# Altium schematic sheet Sheet1.SchDoc
size A2
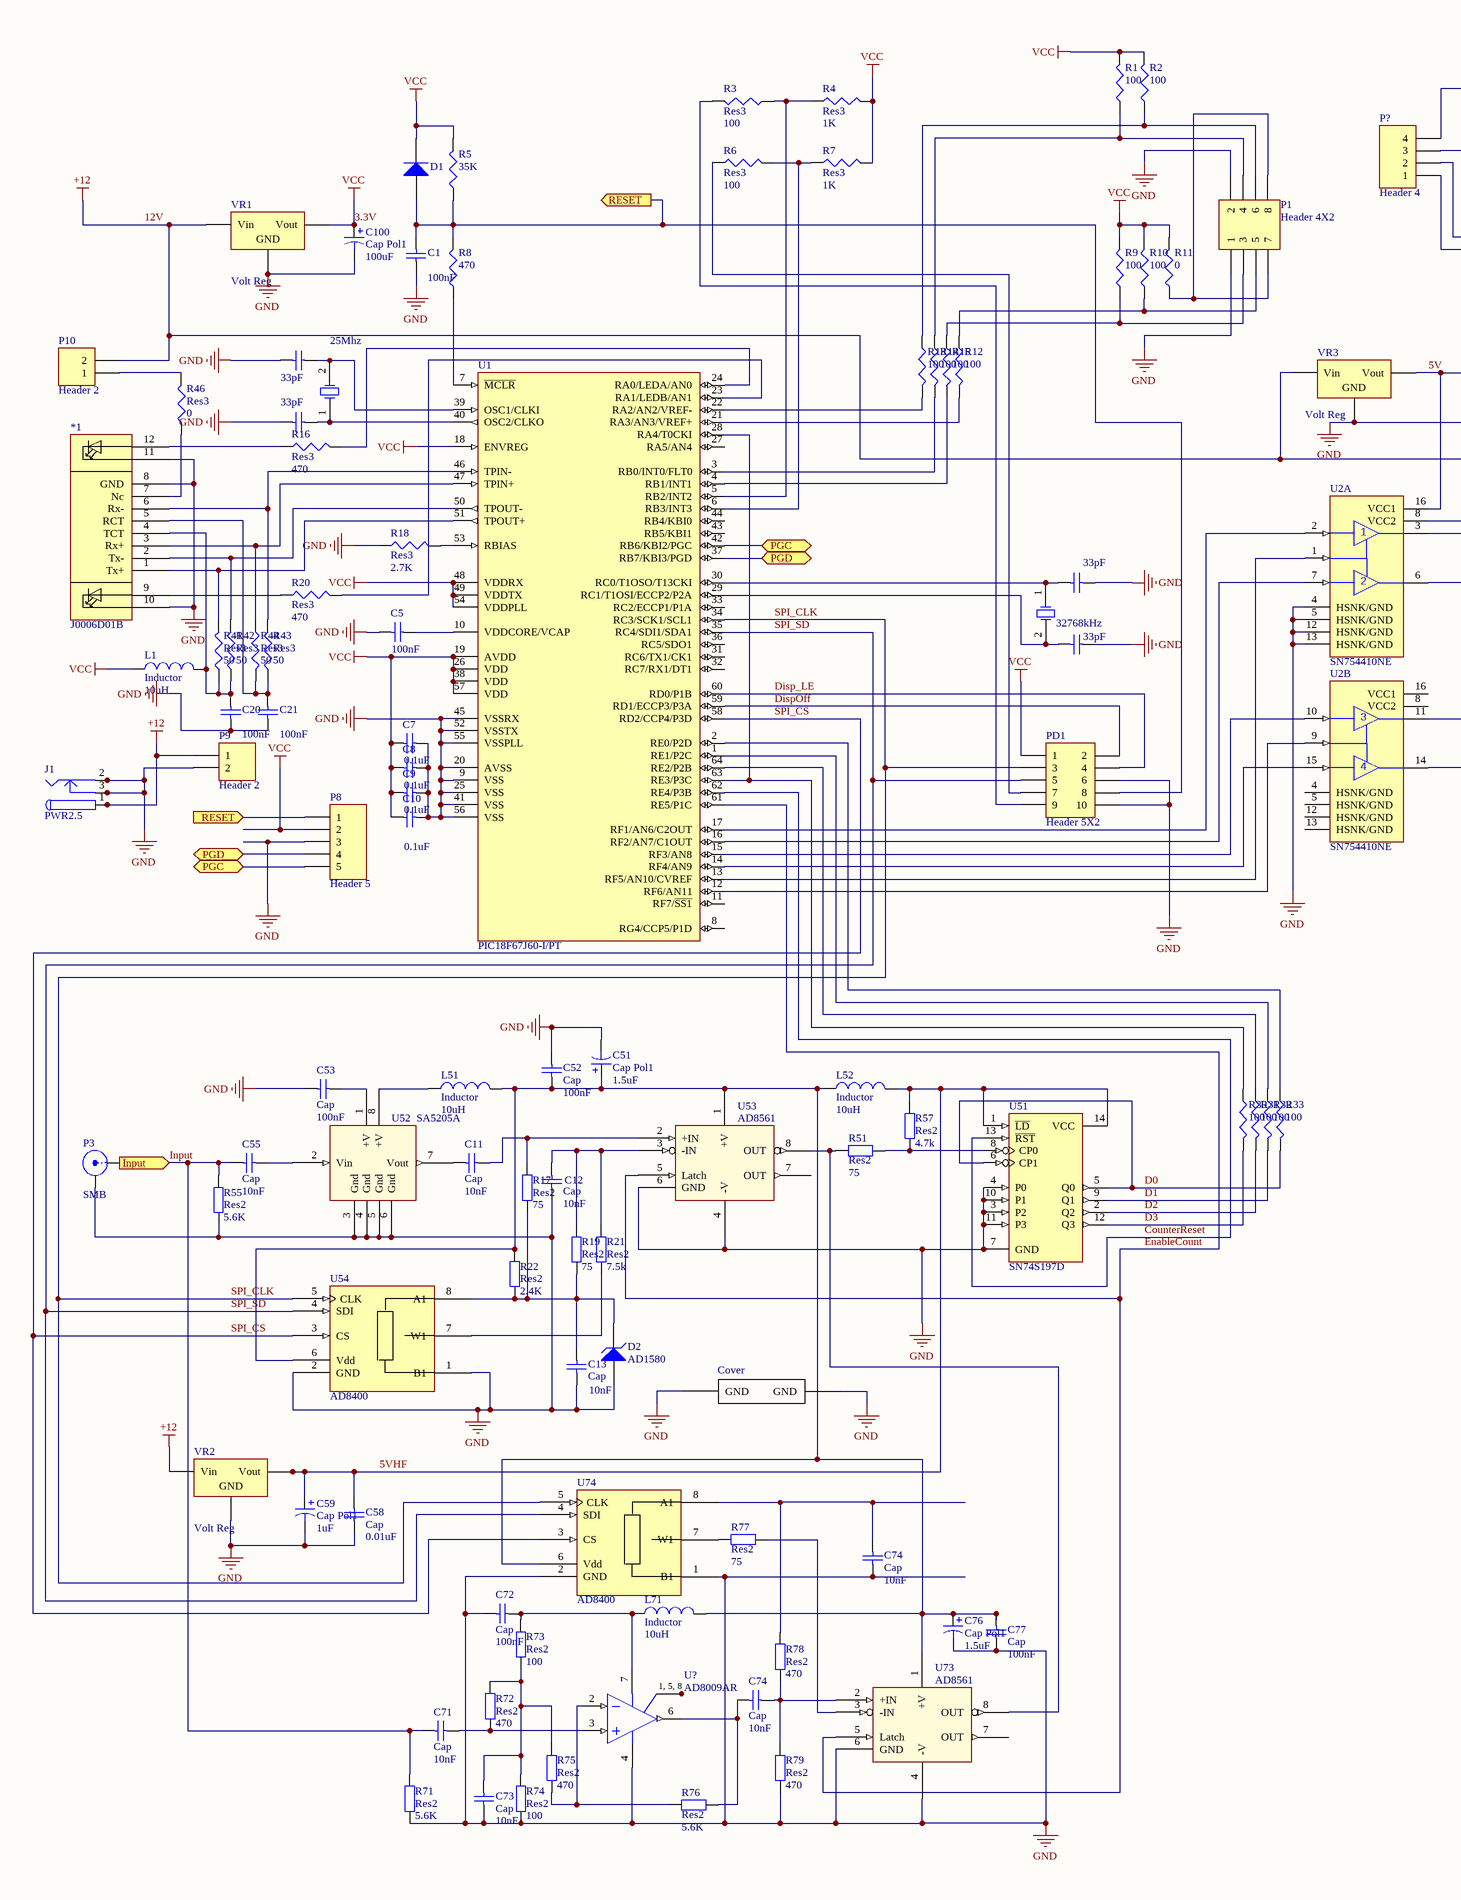
[diagram p0: Sheet1.SchDoc, left]
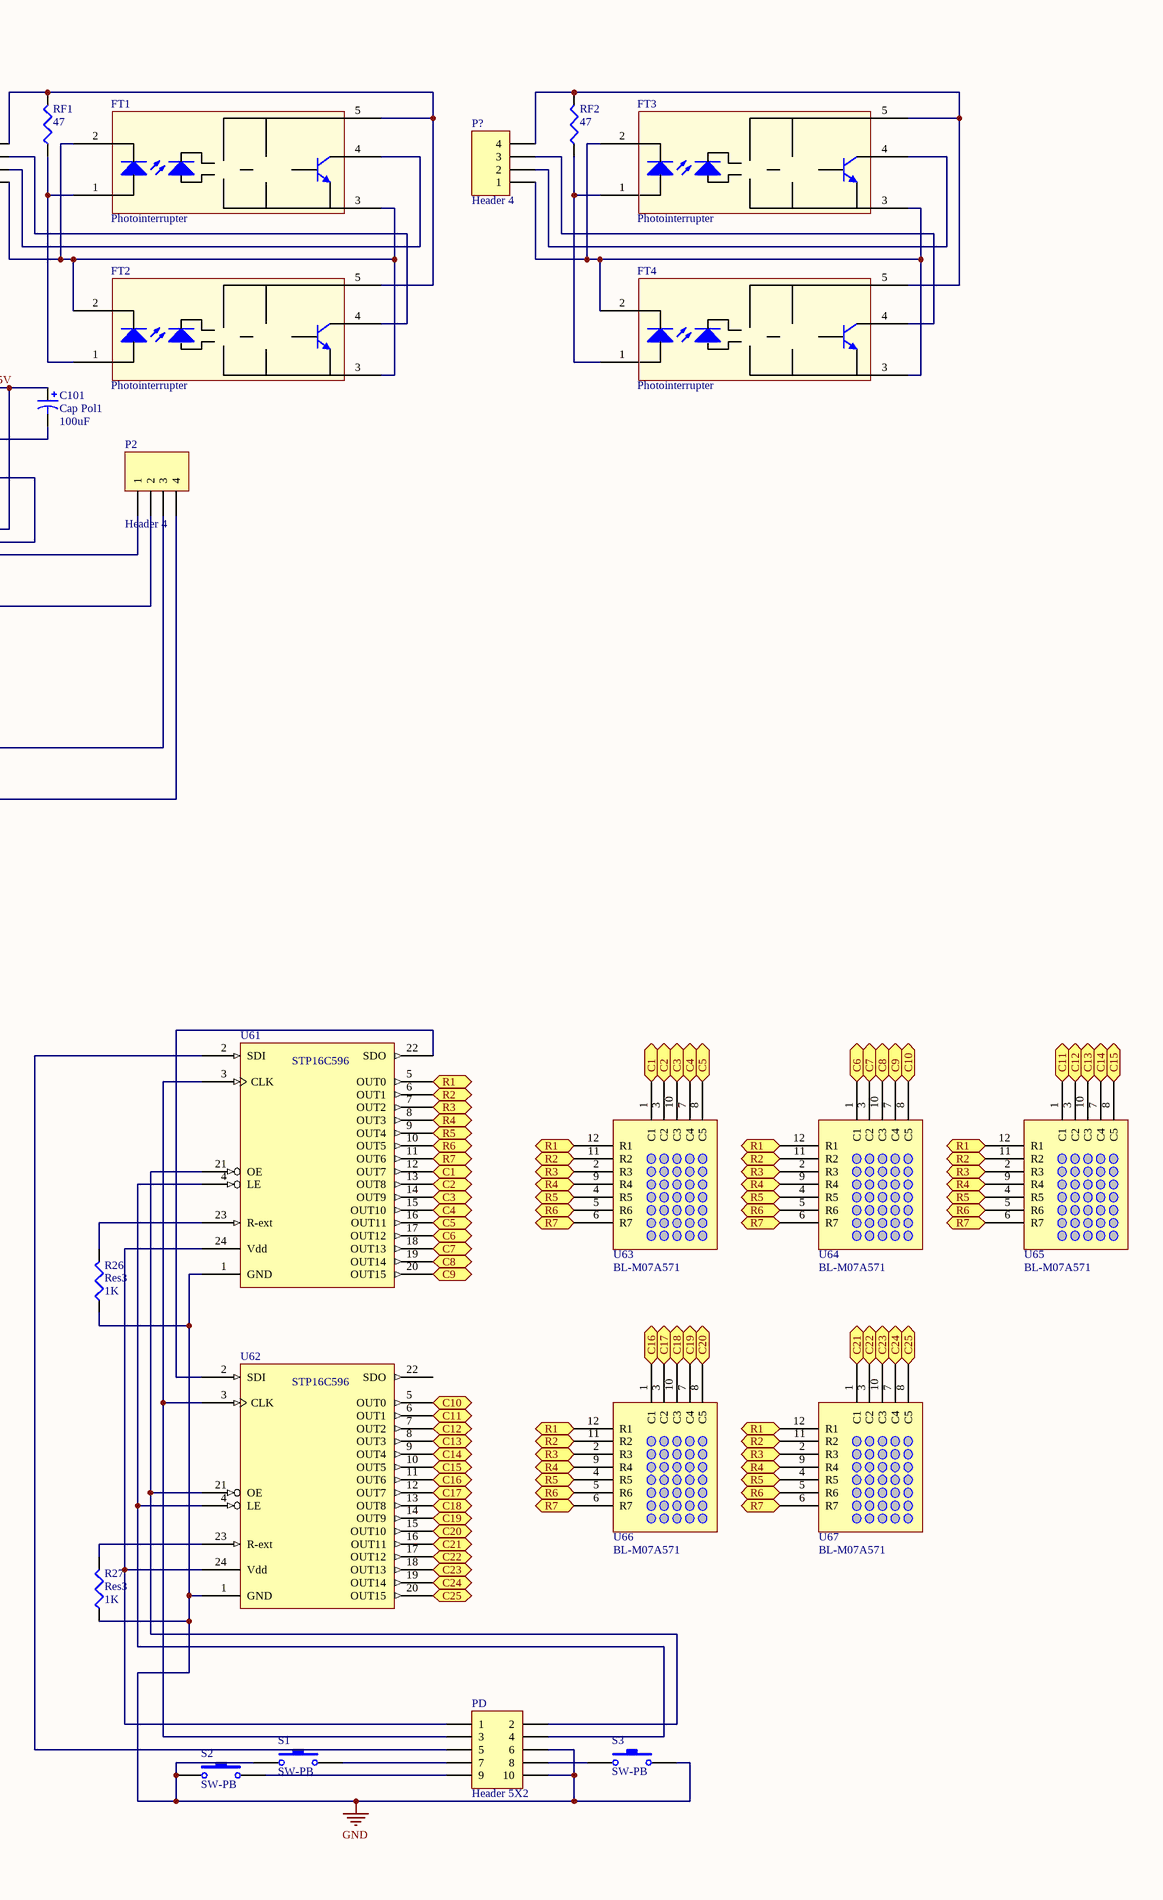
[diagram p1: Sheet1.SchDoc, right]

## Parts
(Parts that share a designator on the sheet are numbered #1, #2 ... from top to bottom, then left to right.)
*1  J0006D01B  [EthernetCON]
C1  value 100nF  [CAPC3225N]  (hidden comment: Cap)
C2  value 33pF  [CAPC2012L]  (hidden comment: Cap)
C3  value 33pF  [CAPC2012L]  (hidden comment: Cap)
C4  value 33pF  [CAPC2012L]  (hidden comment: Cap)
C5  value 100nF  [CAPC4532L]  (hidden comment: Cap)
C6  value 33pF  [CAPC2012L]  (hidden comment: Cap)
C7  value 0.1uF  [CAPC4532L]  (hidden comment: Cap)
C8  value 0.1uF  [CAPC4532L]  (hidden comment: Cap)
C9  value 0.1uF  [CAPC4532L]  (hidden comment: Cap)
C10  value 0.1uF  [CAPC4532L]  (hidden comment: Cap)
C11  Cap  value 10nF  [CAPC2012L]
C12  Cap  value 10nF  [CAPC2012L]
C13  Cap  value 10nF  [CAPC2012L]
C20  value 100nF  [CAPC2512L]  (hidden comment: Cap)
C21  value 100nF  [CAPC2512L]  (hidden comment: Cap)
C51  Cap Pol1  value 1.5uF  [CAPC3225N]
C52  Cap  value 100nF  [CAPC3225N]
C53  Cap  value 100nF  [CAPC3225N]
C55  Cap  value 10nF  [CAPC2012L]
C58  Cap  value 0.01uF  [CAPC3225N]
C59  Cap Pol1  value 1uF  [CAPC3225N]
C71  Cap  value 10nF  [CAPC2012L]
C72  Cap  value 100nF  [CAPC3225N]
C73  Cap  value 10nF  [CAPC2012L]
C74#1  Cap  value 10nF  [CAPC2012L]
C74#2  Cap  value 10nF  [CAPC2012L]
C76  Cap Pol1  value 1.5uF  [CAPC3225N]
C77  Cap  value 100nF  [CAPC3225N]
C100  Cap Pol1  value 100uF  [CAPPR5-5x5]
C101  Cap Pol1  value 100uF  [CAPPR5-5x5]
Cover  Cover  [Cover]  (value not drawn)
D1  Diode  [SOT95P240-3N]  (value not drawn)
D2  AD1580  [SOT95P240-3N]
FT1  Photointerrupter
FT2  Photointerrupter
FT3  Photointerrupter
FT4  Photointerrupter
J1  PWR2.5  [KLD-0202]
L1  Inductor  value 10uH  [INDC2012L]
L51  Inductor  value 10uH  [INDC2012L]
L52  Inductor  value 10uH  [INDC2012L]
L71  Inductor  value 10uH  [INDC2012L]
P1  Header 4X2  [HDR2X4]
P2  Header 4  [HDR1X4]
P3  SMB  [SMB_V-RJ45]
P8  Header 5  [HDR1X5]
P9  Header 2  [HDR1X2]
P10  Header 2  [HDR1X2]
P?#1  Header 4  [HDR1X4]
P?#2  Header 4  [HDR1X4]
PD  Header 5X2  [HDR2X5]
PD1  Header 5X2  [HDR2X5]
R1  value 100  [RESC1608L]  (hidden comment: Res3)
R2  value 100  [RESC1608L]  (hidden comment: Res3)
R3  Res3  value 100  [RESC1608L]
R4  Res3  value 1K  [RESC1608L]
R5  value 35K  [RESC1608L]  (hidden comment: Res3)
R6  Res3  value 100  [RESC1608L]
R7  Res3  value 1K  [RESC1608L]
R8  value 470  [RESC1608L]  (hidden comment: Res3)
R9  value 100  [RESC1608L]  (hidden comment: Res3)
R10  value 100  [RESC1608L]  (hidden comment: Res3)
R11  value 0  [RESC1608L]  (hidden comment: Res3)
R12  value 100  [RESC1608L]  (hidden comment: Res3)
R13  value 100  [RESC1608L]  (hidden comment: Res3)
R14  value 100  [RESC1608L]  (hidden comment: Res3)
R15  value 100  [RESC1608L]  (hidden comment: Res3)
R16  Res3  value 470  [RESC1608L]
R17  Res2  value 75  [RESC2012N]
R18  Res3  value 2.7K  [RESC1608L]
R19  Res2  value 75  [RESC2012N]
R20  Res3  value 470  [RESC1608L]
R21  Res2  value 7.5k  [RESC2012N]
R22  Res2  value 2.4K  [RESC2012N]
R26  Res3  value 1K  [RESC1608L]
R27  Res3  value 1K  [RESC1608L]
R30  value 100  [RESC1608L]  (hidden comment: Res3)
R31  value 100  [RESC1608L]  (hidden comment: Res3)
R32  value 100  [RESC1608L]  (hidden comment: Res3)
R33  value 100  [RESC1608L]  (hidden comment: Res3)
R41  Res3  value 50  [RESC1608L]
R42  Res3  value 50  [RESC1608L]
R43  Res3  value 50  [RESC1608L]
R44  Res3  value 50  [RESC1608L]
R46  Res3  value 0  [RESC1608L]
R51  Res2  value 75  [RESC2012N]
R55  Res2  value 5.6K  [RESC2012N]
R57  Res2  value 4.7k  [RESC2012N]
R71  Res2  value 5.6K  [RESC2012N]
R72  Res2  value 470  [RESC2012N]
R73  Res2  value 100  [RESC2012N]
R74  Res2  value 100  [RESC2012N]
R75  Res2  value 470  [RESC2012N]
R76  Res2  value 5.6K  [RESC2012N]
R77  Res2  value 75  [RESC2012N]
R78  Res2  value 470  [RESC2012N]
R79  Res2  value 470  [RESC2012N]
RF1  value 47  [RESC1608L]  (hidden comment: Res3)
RF2  value 47  [RESC1608L]  (hidden comment: Res3)
S1  SW-PB  [SPST-2]
S2  SW-PB  [SPST-2]
S3  SW-PB  [SPST-2]
U1  PIC18F67J60-I/PT  [TQFP-PT64_N]
U2  SN754410NE  [NE016]  (parts A,B of 2)
U51  SN74S197D  [D014_N]
U52  SA5205A  [SOIC127P600-8L]
U53  AD8561  [SOIC127P600-8L]
U54  AD8400  [SOIC127P600-8L]
U61  STP16C596  [DB024]
U62  STP16C596  [DB024]
U63  BL-M07A571  [LED matrix 7x5]
U64  BL-M07A571  [LED matrix 7x5]
U65  BL-M07A571  [LED matrix 7x5]
U66  BL-M07A571  [LED matrix 7x5]
U67  BL-M07A571  [LED matrix 7x5]
U73  AD8561  [SOIC127P600-8L]
U74  AD8400  [SOIC127P600-8L]
U?  AD8009AR  [SO-8_N]
VR1  Volt Reg  [SOT223-4N]
VR2  Volt Reg  [SOT89N]
VR3  Volt Reg  [SOT89N]
Y1  value 25Mhz  [Quartz]  (hidden comment: XTAL)
Y2  value 32768kHz  [Quartz]  (hidden comment: Z)

## Ports
C1, C2, C3, C4, C5, C6, C7, C8, C9, C10, C11, C12, C13, C14, C15, C16, C17, C18, C19, C20, C21, C22, C23, C24, C25, Input (in), PGC (bidir), PGD (bidir), R1, R2, R3, R4, R5, R6, R7, RESET (in), RESET (out)

## Nets
3.3V: C7.2 C8.2 C9.2 C10.2 C100.1 D1.2(K) L1.1 P8.2 PD1.1 R1.2 R2.2 R4.2 R5.2 R7.2 R9.2 R10.2 R11.2 U1.18(ENVREG) U1.19(AVDD) U1.26(VDD) U1.38(VDD) U1.48(VDDRX) U1.49(VDDTX) U1.54(VDDPLL) U1.57(VDD) VR1.3(Vout)  [also labelled VCC]
12V: J1.1 J1.1A J1.1B P9.1 P10.2 U2.8(VCC2) VR1.1(Vin) VR2.1(Vin) VR3.1(Vin)  [also labelled +12]
GND: *1.8(GND) *1.10 *1.11 C1.1 C2.1 C3.2 C4.2 C5.2 C6.1 C7.1 C8.1 C9.1 C10.1 C12.1 C13.1 C20.1 C21.1 C51.2 C52.2 C53.1 C58.1 C59.2 C72.1 C73.1 C74#1.1 C76.2 C77.2 C100.2 C101.2 Cover.1(GND) Cover.2(GND) D2.1(A) J1.2 J1.2A J1.2B J1.3 J1.3A J1.3B P1.1 P1.2 P3.2(Y) P8.3 P9.2 PD.6 PD.10 PD1.6 PD1.10 R18.1 R26.1 R27.1 R55.1 R71.1 R74.1 R79.1 S1.1 S2.1 S3.2 U1.9(VSS) U1.20(AVSS) U1.25(VSS) U1.41(VSS) U1.45(VSSRX) U1.52(VSSTX) U1.55(VSSPLL) U1.56(VSS) U2.4(HSNK/GND) U2.5(HSNK/GND) U2.12(HSNK/GND) U2.13(HSNK/GND) U51.3(P2) U51.4(P0) U51.7(GND) U51.10(P1) U51.11(P3) U52.3(Gnd) U52.4(Gnd) U52.5(Gnd) U52.6(Gnd) U53.4(-V) U53.6(GND) U54.1(B1) U54.2(GND) U61.1(GND) U62.1(GND) U73.4(-V) U73.6(GND) U74.1(B1) U74.2(GND) U?.4(V-) VR1.2(GND) VR2.2(GND) VR3.2(GND)
5V: C101.1 U2.16(VCC1) VR3.3(Vout)
5VHF: C58.2 C59.1 L52.2 R57.1 U51.1(~{LD}) U51.14(VCC) VR2.3(Vout)
C1: U61.12(OUT7) U63.1(C1) ; port C1
C2: U61.13(OUT8) U63.3(C2) ; port C2
C3: U61.14(OUT9) U63.10(C3) ; port C3
C4: U61.15(OUT10) U63.7(C4) ; port C4
C5: U61.16(OUT11) U63.8(C5) ; port C5
C6: U61.17(OUT12) U64.1(C1) ; port C6
C7: U61.18(OUT13) U64.3(C2) ; port C7
C8: U61.19(OUT14) U64.10(C3) ; port C8
C9: U61.20(OUT15) U64.7(C4) ; port C9
C10: U62.5(OUT0) U64.8(C5) ; port C10
C11: U62.6(OUT1) U65.1(C1) ; port C11
C12: U62.7(OUT2) U65.3(C2) ; port C12
C13: U62.8(OUT3) U65.10(C3) ; port C13
C14: U62.9(OUT4) U65.7(C4) ; port C14
C15: U62.10(OUT5) U65.8(C5) ; port C15
C16: U62.11(OUT6) U66.1(C1) ; port C16
C17: U62.12(OUT7) U66.3(C2) ; port C17
C18: U62.13(OUT8) U66.10(C3) ; port C18
C19: U62.14(OUT9) U66.7(C4) ; port C19
C20: U62.15(OUT10) U66.8(C5) ; port C20
C21: U62.16(OUT11) U67.1(C1) ; port C21
C22: U62.17(OUT12) U67.3(C2) ; port C22
C23: U62.18(OUT13) U67.10(C3) ; port C23
C24: U62.19(OUT14) U67.7(C4) ; port C24
C25: U62.20(OUT15) U67.8(C5) ; port C25
CounterReset: U1.62(RE4/P3B) U51.13(~{RST})
D0: R33.2 U51.5(Q0) U51.6(CP1)
D1: R32.2 U51.9(Q1)
D2: R31.2 U51.2(Q2)
D3: R30.2 U51.12(Q3)
Disp_LE: PD1.4 U1.60(RD0/P1B)
DispOff: PD1.2 U1.59(RD1/ECCP3/P3A)
EnableCount: U1.61(RE5/P1C) U53.5(Latch) U73.5(Latch)
Input: C55.1 C71.1 P3.1(X) R55.2 R71.2 ; port Input
PGC: P8.5 U1.42(RB6/KBI2/PGC) ; port PGC
PGD: P8.4 U1.37(RB7/KBI3/PGD) ; port PGD
R1: U61.5(OUT0) U63.12(R1) U64.12(R1) U65.12(R1) U66.12(R1) U67.12(R1) ; port R1
R2: U61.6(OUT1) U63.11(R2) U64.11(R2) U65.11(R2) U66.11(R2) U67.11(R2) ; port R2
R3: U61.7(OUT2) U63.2(R3) U64.2(R3) U65.2(R3) U66.2(R3) U67.2(R3) ; port R3
R4: U61.8(OUT3) U63.9(R4) U64.9(R4) U65.9(R4) U66.9(R4) U67.9(R4) ; port R4
R5: U61.9(OUT4) U63.4(R5) U64.4(R5) U65.4(R5) U66.4(R5) U67.4(R5) ; port R5
R6: U61.10(OUT5) U63.5(R6) U64.5(R6) U65.5(R6) U66.5(R6) U67.5(R6) ; port R6
R7: U61.11(OUT6) U63.6(R7) U64.6(R7) U65.6(R7) U66.6(R7) U67.6(R7) ; port R7
RESET: C1.2 D1.1(A) P8.1 PD1.8 R5.1 R8.2 ; port RESET
SPI_CLK: PD1.3 U1.34(RC3/SCK1/SCL1) U54.5(CLK) U74.5(CLK)
SPI_CS: U1.58(RD2/CCP4/P3D) U54.3(CS) U74.3(CS)
SPI_SD: PD1.5 U1.35(RC4/SDI1/SDA1) U54.4(SDI) U74.4(SDI)
Net*1_1: *1.1(Tx+) R41.2 U1.51(TPOUT+)
Net*1_2: *1.2(Tx-) R42.2 U1.50(TPOUT-)
Net*1_3: *1.3(Rx+) R44.1 U1.47(TPIN+)
Net*1_4: *1.4(TCT) C20.2 L1.2 R41.1 R42.1
Net*1_5: *1.5(RCT) C21.2 R43.1 R44.2
Net*1_6: *1.6(Rx-) R43.2 U1.46(TPIN-)
Net*1_7: *1.7(Nc) R46.1
Net*1_9: *1.9 R20.1
Net*1_12: *1.12 R16.1
NetC2_2: C2.2 U1.39(OSC1/CLKI) Y1.2(OSC2)
NetC3_1: C3.1 U1.40(OSC2/CLKO) Y1.1(OSC1)
NetC4_1: C4.1 U1.30(RC0/T1OSO/T13CKI) Y2.1(OSC1)
NetC5_1: C5.1 U1.10(VDDCORE/VCAP)
NetC6_2: C6.2 U1.29(RC1/T1OSI/ECCP2/P2A) Y2.2(OSC2)
NetC11_1: C11.1 U52.7(Vout)
NetC11_2: C11.2 R17.2 U53.2(+IN)
NetC12_2: C12.2 R19.2 R21.2 U53.3(-IN)
NetC13_2: C13.2 D2.2(K) R17.1 R19.1 R22.1 U54.8(A1)
NetC51_1: C51.1 C52.1 C76.1 C77.1 L51.2 L52.1 L71.2 R22.2 U53.1(+V) U54.6(Vdd) U73.1(+V) U74.6(Vdd)
NetC53_2: C53.2 U52.1(+V)
NetC55_2: C55.2 U52.2(Vin)
NetC71_2: C71.2 R72.1 U?.3(IN+)
NetC72_2: C72.2 L71.1 R73.2 U?.7(V+)
NetC73_2: C73.2 R72.2 R73.1 R74.2 R75.2
NetC74#1_2: C74#1.2 R78.2 U74.8(A1)
NetC74#2_1: C74#2.1 R76.1 U?.6(OUT)
NetC74#2_2: C74#2.2 R78.1 R79.2 U73.2(+IN)
NetFT1_1: FT1.1 FT2.1 RF1.1
NetFT1_2: FT1.2 FT1.3 FT2.2 FT2.3 P?#1.1
NetFT1_4: FT1.4 P?#1.2
NetFT1_5: FT1.5 FT2.5 P?#1.4 RF1.2
NetFT2_4: FT2.4 P?#1.3
NetFT3_1: FT3.1 FT4.1 RF2.1
NetFT3_2: FT3.2 FT3.3 FT4.2 FT4.3 P?#2.1
NetFT3_4: FT3.4 P?#2.2
NetFT3_5: FT3.5 FT4.5 P?#2.4 RF2.2
NetFT4_4: FT4.4 P?#2.3
NetL51_1: L51.1 U52.8(+V)
NetP1_3: P1.3 R9.1 R15.1
NetP1_4: P1.4 R1.1 R14.1
NetP1_5: P1.5 R10.1 R12.1
NetP1_6: P1.6 R2.1 R13.1
NetP1_7: P1.7 P1.8 R11.1
NetP2_1: P2.1 U2.3(1Y)
NetP2_2: P2.2 U2.6(2Y)
NetP2_3: P2.3 U2.11(3Y)
NetP2_4: P2.4 U2.14(4Y)
NetP10_1: P10.1 R46.2
NetPD1_7: PD1.7 R6.1
NetPD1_9: PD1.9 R3.2
NetPD_1: PD.1 U61.24(Vdd) U62.24(Vdd)
NetPD_2: PD.2 U61.21(OE) U62.21(OE)
NetPD_3: PD.3 U61.3(CLK) U62.3(CLK)
NetPD_4: PD.4 U61.4(LE) U62.4(LE)
NetPD_5: PD.5 U61.2(SDI)
NetPD_7: PD.7 S1.2
NetPD_8: PD.8 S3.1
NetPD_9: PD.9 S2.2
NetR3_1: R3.1 R4.1 U1.5(RB2/INT2)
NetR6_2: R6.2 R7.1 U1.6(RB3/INT3)
NetR8_1: R8.1 U1.7(~{MCLR})
NetR12_2: R12.2 U1.21(RA3/AN3/VREF+)
NetR13_2: R13.2 U1.22(RA2/AN2/VREF-)
NetR14_2: R14.2 U1.3(RB0/INT0/FLT0)
NetR15_2: R15.2 U1.4(RB1/INT1)
NetR16_2: R16.2 U1.24(RA0/LEDA/AN0)
NetR18_2: R18.2 U1.53(RBIAS)
NetR20_2: R20.2 U1.23(RA1/LEDB/AN1)
NetR21_1: R21.1 U54.7(W1)
NetR26_2: R26.2 U61.23(R-ext)
NetR27_2: R27.2 U62.23(R-ext)
NetR30_1: R30.1 U1.28(RA4/T0CKI) U1.63(RE3/P3C)
NetR31_1: R31.1 U1.64(RE2/P2B)
NetR32_1: R32.1 U1.1(RE1/P2C)
NetR33_1: R33.1 U1.2(RE0/P2D)
NetR51_1: R51.1 R57.2 U51.8(CP0)
NetR51_2: R51.2 U53.8(OUT) U73.8(OUT)
NetR75_1: R75.1 R76.2 U?.2(IN-)
NetR77_1: R77.1 U73.3(-IN)
NetR77_2: R77.2 U74.7(W1)
NetU1_12: U1.12(RF6/AN11) U2.9(3,4EN)
NetU1_13: U1.13(RF5/AN10/CVREF) U2.1(1,2EN)
NetU1_14: U1.14(RF4/AN9) U2.15(4A)
NetU1_15: U1.15(RF3/AN8) U2.10(3A)
NetU1_16: U1.16(RF2/AN7/C1OUT) U2.7(2A)
NetU1_17: U1.17(RF1/AN6/C2OUT) U2.2(1A)
NetU61_22: U61.22(SDO) U62.2(SDI)
NetU?_1: U?.1(NC) U?.5(NC) U?.8(NC)

Not connected (* = marked no-connect by the designer): U1 8(RG4/CCP5/P1D) 11(RF7/~{SS1}) 27(RA5/AN4) 31(RC6/TX1/CK1) 32(RC7/RX1/DT1) 33(RC2/ECCP1/P1A) 36(RC5/SDO1) 43(RB5/KBI1) 44(RB4/KBI0); U53 7(OUT); U62 22(SDO); U73 7(OUT)

## Notes on the sheet
- (in symbol AD8009AR) 1, 5, 8

## Library data of the parts
*1 Cover FT3 = Component_1
C1-C13 C20 C21 C52 C53 C55 C58 C71-C73 C74#1 C74#2 C77 = Cap: Capacitor; Published: 8-Jun-2000; LatestRevisionDate: 17-Jul-2002; LatestRevisionNote: Re-released for DXP Platform.; PackageReference: RAD-0.3; Publisher: Altium Limited
C51 C59 C76 C100 C101 = Cap Pol1: Polarized Capacitor (Radial); Published: 8-Jun-2000; LatestRevisionDate: 17-Jul-2002; LatestRevisionNote: Re-released for DXP Platform.; PackageReference: RB7.6-15; Publisher: Altium Limited
D1 = Diode: Default Diode; Published: 8-Jun-2000; LatestRevisionDate: 17-Jul-2002; LatestRevisionNote: Re-released for DXP Platform.; PackageVersion: Sep-1996; PackageReference: SMC; Publisher: Altium Limited; Code_JEDEC: DO-214-AB
D2 = D Zener: Zener Diode; Published: 8-Jun-2000; LatestRevisionDate: 17-Jul-2002; LatestRevisionNote: Re-released for DXP Platform.; PackageReference: DIODE-0.7; Publisher: Altium Limited
FT1 FT2 FT4 = Component_1: RPI-1133
J1 = PWR2.5: Low Voltage Power Supply Connector; Published: 17-Dec-2003; DatasheetDocument: 09-May-2002; Publisher: Altium Limited; ComponentLink1Description: Manufacturer Link; ComponentLink1URL: http://domino.kycon.com/internet/Products.html
L1 L51 L52 L71 = Inductor: Code_IEC: 1005; Published: 8-Jun-2000; LatestRevisionDate: 29-May-2009; LatestRevisionNote: IPC-7351 Footprint Added.; PackageReference: 0402-A; Publisher: Altium Limited; PackageDescription: Chip Inductor; Code_JEITA: 0402
P1 = Header 4X2: Header, 4-Pin, Dual row; LatestRevisionDate: 17-Jul-2002; LatestRevisionNote: Re-released for DXP Platform.; Publisher: Altium Limited
P2 P?#1 P?#2 = Header 4: Header, 4-Pin; LatestRevisionDate: 17-Jul-2002; LatestRevisionNote: Re-released for DXP Platform.; Publisher: Altium Limited
P3 = SMB: SMB Straight Connector; LatestRevisionDate: 17-Jul-2002; LatestRevisionNote: Re-released for DXP Platform.; Publisher: Altium Limited
P8 = Header 5: Header, 5-Pin; LatestRevisionDate: 17-Jul-2002; LatestRevisionNote: Re-released for DXP Platform.; Publisher: Altium Limited
P9 P10 = Header 2: Header, 2-Pin; LatestRevisionDate: 17-Jul-2002; LatestRevisionNote: Re-released for DXP Platform.; Publisher: Altium Limited
PD PD1 = Header 5X2: Header, 5-Pin, Dual row; LatestRevisionDate: 17-Jul-2002; LatestRevisionNote: Re-released for DXP Platform.; Publisher: Altium Limited
R1-R16 R18 R20 R26 R27 R30-R33 R41-R44 R46 RF1 RF2 = Res3: Resistor; Published: 8-Jun-2000; LatestRevisionDate: 29-May-2009; LatestRevisionNote: IPC-7351 Footprint Added.; PackageReference: J1-0603; Publisher: Altium Limited; PackageDescription: Chip Resistor
R17 R19 R21 R22 R51 R55 R57 R71-R79 = Res2: Resistor; Published: 8-Jun-2000; LatestRevisionDate: 17-Jul-2002; LatestRevisionNote: Re-released for DXP Platform.; PackageReference: AXIAL-0.4; Publisher: Altium Limited
S1-S3 = SW-PB: Switch; Published: 24-Mar-1999; LatestRevisionDate: 17-Jul-2002; LatestRevisionNote: Re-released for DXP Platform.; PackageReference: SPST-2; Publisher: Altium Limited
U1 = PIC18F67J60-I/PT: High Performance, 1-Mbit Flash Microcontroller with Ethernet, 128K Flash, 64-Pin TQFP, Industrial Temperature Range; Published: 29-Jan-2009; DatasheetVersion: revD, Feb-2008; PackageVersion: revAW, Oct-2008; PackageReference: TQFP-PT64; Publisher: Altium Limited; PackageDescription: 64-Lead Thin Plastic Quad Flat Pack (PT) - 10x10x1mm Body, 2.00mm [TQFP]; Code_JEDEC: MS-026; ComponentLink1Description: Manufacturer Link; ComponentLink1URL: http://www.microchip.com; ComponentLink2Description: Datasheet; ComponentLink2URL: http://ww1.microchip.com/downloads/en/DeviceDoc/39762d.pdf; ComponentLink3Description: Packaging Specification; ComponentLink3URL: http://ww1.microchip.com/downloads/en/PackagingSpec/00049AW.pdf
U2 = SN754410NE: Quadruple Half-H Driver; Published: 15-May-2002; LatestRevisionDate: 29-May-2009; LatestRevisionNote: Component Body Added.; DatasheetVersion: May-1990; PackageVersion: 1991; PackageReference: NE016; Publisher: Altium Limited; PackageDescription: DIP, 16-Pin, Row Spacing 7.62 mm, Pitch 2.54 mm; Code_JEDEC: MS-001-BB; ComponentLink1Description: Manufacturer Link; ComponentLink1URL: http://www.ti.com/; ComponentLink2Description: Datasheet; ComponentLink2URL: http://www-s.ti.com/sc/ds/sn754410.pdf
U51 = SN74S197D: 100-MHz Presettable Decade or Binary Counter / Latch; Published: 8-Jun-2000; LatestRevisionDate: 13-Apr-2006; LatestRevisionNote: IPC-7351 Footprint Added.; DatasheetVersion: Mar-1988; PackageVersion: Jan-1998; PackageReference: D014; Publisher: Altium Limited; PackageDescription: 14-Pin Small Outline Integrated Circuit 1.27 mm Pitch; Code_IPC: SOIC127P600-14; ComponentLink1Description: Manufacturer Link; ComponentLink1URL: http://www.ti.com/; ComponentLink2Description: Datasheet; ComponentLink2URL: http://www-s.ti.com/sc/ds/sn54196.pdf
U52 = SA5205A: Wide-band high-frequency amplifier
U53 U73 = AD8561: Ultrafast 7 ns  Single Supply Comparator
U54 U74 = AD8400: Digital Potentiometers
U? = AD8009AR: 1 GHz, 5,500 V/uS Low Distortion Amplifier; Note: Pin 1, 5 and 8 are not connected; Published: 8-Jun-2000; LatestRevisionDate: 13-Apr-2006; LatestRevisionNote: IPC-7351 Footprint Added.; DatasheetVersion: REV. 0 1996; PackageVersion: revA; PackageReference: SO-8; Publisher: Altium Limited; PackageDescription: 8-Pin Small Outline Integrated Circuit 1.27 mm Pitch; Code_JEDEC: MS-012-AA; Code_IPC: SOIC127P600-8; ComponentLink1Description: Manufacturer Link; ComponentLink1URL: http://www.analog.com/en/prod/0,,759_786_AD8009%2C00.html; ComponentLink2Description: Datasheet; ComponentLink2URL: http://www.analog.com/UploadedFiles/Data_Sheets/415408195AD8009_f.pdf
VR1-VR3 = Volt Reg: Voltage Regulator; Published: 24-Mar-1999; LatestRevisionDate: 29-May-2009; LatestRevisionNote: IPC-7351 Footprint Added.; PackageReference: D2PAK; Publisher: Altium Limited; PackageDescription: 3-Pin Transistor Outline Package 2.54 mm Pitch, 15.1 mm Lead Span
Y1 = XTAL: Crystal Oscillator; Published: 8-Jun-2000; LatestRevisionDate: 17-Jul-2002; LatestRevisionNote: Re-released for DXP Platform.; PackageReference: R38; Publisher: Altium Limited
Y2 = XTAL: 32768 kHz; Published: 8-Jun-2000; LatestRevisionDate: 17-Jul-2002; LatestRevisionNote: Re-released for DXP Platform.; PackageReference: R38; Publisher: Altium Limited